# EAGLE design relaiscard (EAGLE 4.15)
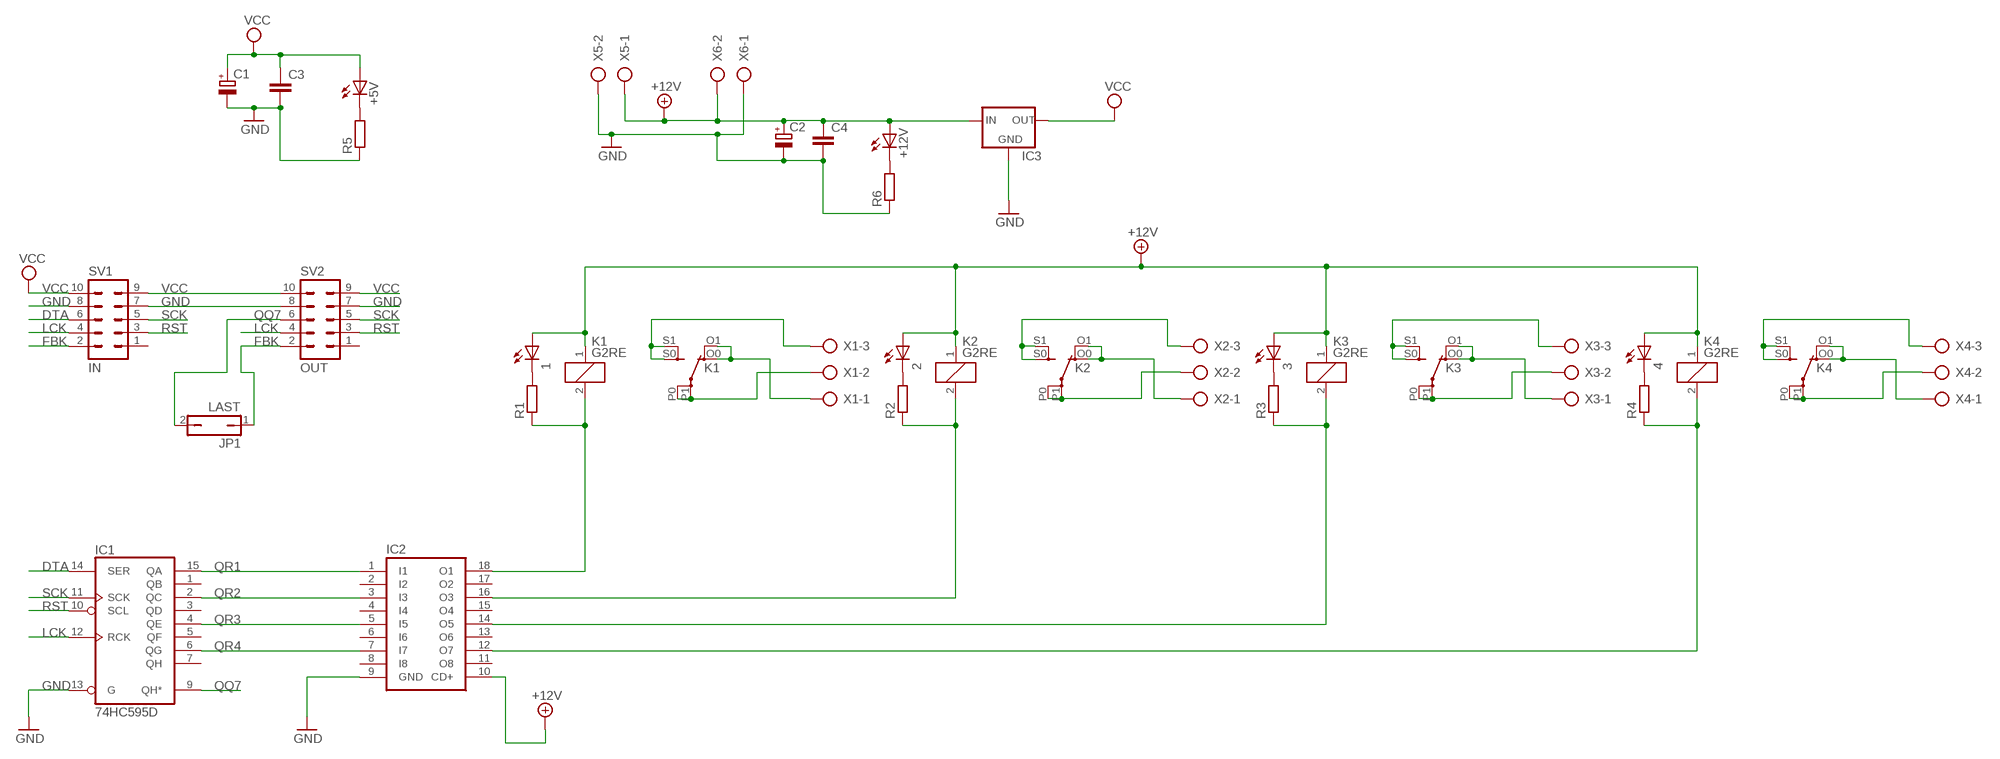
[diagram p0: schematic, sheet 1]

## Parts
1  LEDCHIPLED_1206  [CHIPLED_1206]
2  LEDCHIPLED_1206  [CHIPLED_1206]
3  LEDCHIPLED_1206  [CHIPLED_1206]
4  LEDCHIPLED_1206  [CHIPLED_1206]
+5V  LEDCHIPLED_1206  [CHIPLED_1206]
+12V  LEDCHIPLED_1206  [CHIPLED_1206]
C1  CPOL-EUE2.5-6  [E2,5-6]
C2  CPOL-EUE2.5-6  [E2,5-6]
C3  C-EUC1206  [C1206]
C4  C-EUC1206  [C1206]
IC1  74HC595D  [SO16]
IC2  ULN2803A  [DIL18]
IC3  78XXS  [78XXS]
JP1  LAST  JP1Q  [JP1]
K1  G2RE  [G2RE]
K2  G2RE  [G2RE]
K3  G2RE  [G2RE]
K4  G2RE  [G2RE]
R1  R-EU_M1206  [M1206]
R2  R-EU_M1206  [M1206]
R3  R-EU_M1206  [M1206]
R4  R-EU_M1206  [M1206]
R5  R-EU_M1206  [M1206]
R6  R-EU_M1206  [M1206]
SV1  IN  ML10  [ML10]
SV2  OUT  ML10  [ML10]
X1  AK500/3  [AK500/3]
X2  AK500/3  [AK500/3]
X3  AK500/3  [AK500/3]
X4  AK500/3  [AK500/3]
X5  AK500/2  [AK500/2]
X6  AK500/2  [AK500/2]

## Nets
+12V: 1.A 2.A 3.A 4.A +12V.A C2.+ C4.1 IC2.10(CD+) IC3.IN K1.1 K2.1 K3.1 K4.1 X5.1 X6.2
DTA: IC1.14(SER) SV1.6
FBK: JP1.1 SV1.2 SV2.2
GND: C1.- C2.- C3.2 C4.2 IC1.13(G) IC2.9(GND) IC3.GND R5.1 R6.1 SV1.7 SV1.8 SV2.7 SV2.8 X5.2 X6.1
LCK: IC1.12(RCK) SV1.4 SV2.4
N$1: K1.P0(2:P) K1.P1(2:P) X1.2
N$2: K1.S0(2:S) K1.S1(2:S) X1.3
N$3: K2.P0(2:P) K2.P1(2:P) X2.2
N$4: K1.O0(2:O) K1.O1(2:O) X1.1
N$5: K2.O0(2:O) K2.O1(2:O) X2.1
N$6: K2.S0(2:S) K2.S1(2:S) X2.3
N$7: K3.S0(2:S) K3.S1(2:S) X3.3
N$8: K3.O0(2:O) K3.O1(2:O) X3.1
N$9: K3.P0(2:P) K3.P1(2:P) X3.2
N$10: K4.S0(2:S) K4.S1(2:S) X4.3
N$11: K4.O0(2:O) K4.O1(2:O) X4.1
N$12: K4.P0(2:P) K4.P1(2:P) X4.2
N$13: IC2.18(O1) K1.2 R1.1
N$14: IC2.16(O3) K2.2 R2.1
N$15: IC2.14(O5) K3.2 R3.1
N$16: IC2.12(O7) K4.2 R4.1
N$19: +5V.C R5.2
N$20: 1.C R1.2
N$21: 2.C R2.2
N$22: 3.C R3.2
N$23: 4.C R4.2
N$26: +12V.C R6.2
QQ7: IC1.9(QH*) JP1.2 SV2.6
QR1: IC1.15(QA) IC2.1(I1)
QR2: IC1.2(QC) IC2.3(I3)
QR3: IC1.4(QE) IC2.5(I5)
QR4: IC1.6(QG) IC2.7(I7)
RST: IC1.10(SCL) SV1.3 SV2.3
SCK: IC1.11(SCK) SV1.5 SV2.5
VCC: +5V.A C1.+ C3.1 IC3.OUT SV1.9 SV1.10 SV2.9 SV2.10
Unconnected: IC1.1(QB) IC1.3(QD) IC1.5(QF) IC1.7(QH) IC2.2(I2) IC2.4(I4) IC2.6(I6) IC2.8(I8) IC2.11(O8) IC2.13(O6) IC2.15(O4) IC2.17(O2) SV1.1 SV2.1

## Power pins joined to a net without a drawn wire
GND: IC1.8(GND)
VCC: IC1.16(VCC)

## Library data of the parts
1-4 +5V +12V = led:LED: LED OSRAM: - CHIPLED LG R971, LG N971, LY N971, LG Q971, LY Q971, LO R971, LY R971 LH N974, LH R974 LS Q976, LO Q976, LY Q976 LO Q996 - Hyper CHIPLED LW Q18S LB Q993, LB Q99A, LB R99A - SideLED LS A670, LO A670, LY A670, LG A670, LP A670 LB A673, LV A673, LT A673, LW A673 LH A674 LY A675 LS A676, LA A676, LO A676, LY A676, LW A676 LS A679, LY A679, LG A679 - Hyper Micro SIDELED® LS Y876, LA Y876, LO Y876, LY Y876 LT Y87S - SmartLED LW L88C, LW L88S LB L89C, LB L89S, LG L890 LS L89K, LO L89K, LY L89K LS L896, LA L896, LO L896, LY L896 - TOPLED LS T670, LO T670, LY T670, LG T670, LP T670 LSG T670, LSP T670, LSY T670, LOP T670, LYG T670 LG T671, LOG T671, LSG T671 LB T673, LV T673, LT T673, LW T673 LH T674 LS T676, LA T676, LO T676, LY T676, LB T676, LH T676, LSB T676, LW T676 LB T67C, LV T67C, LT T67C, LS T67K, LO T67K, LY T67K, LW E67C LS E67B, LA E67B, LO E67B, LY E67B, LB E67C, LV E67C, LT E67C LW T67C LS T679, LY T679, LG T679 LS T770, LO T770, LY T770, LG T770, LP T770 LB T773, LV T773, LT T773, LW T773 LH T774 LS E675, LA E675, LY E675, LS T675 LS T776, LA T776, LO T776, LY T776, LB T776 LHGB T686 LT T68C, LB T68C - Hyper Mini TOPLED® LB M676 - Mini TOPLED Santana® LG M470 LS M47K, LO M47K, LY M47K Source: http://www.osram.convergy.de/
C1 C2 = relaiscard:CPOL-EU: POLARIZED CAPACITOR, European symbol
C3 C4 = rcl:C-EU: CAPACITOR, European symbol
IC1 = 74xx-eu:74*595: 8-bit SHIFT REGISTER, output latch
IC2 = relaiscard:ULN2803A: DRIVER ARRAY
IC3 = relaiscard:78XXS: VOLTAGE REGULATOR
JP1 = relaiscard:JP1Q: JUMPER
K1-K4 = relaiscard:G2RE: RELAY 1 x switch, high current, Omron
R1-R6 = rcl:R-EU_: RESISTOR, European symbol
SV1 SV2 = relaiscard:ML10: HARTING
X1-X4 = relaiscard:AK500/3: CONNECTOR
X5 X6 = relaiscard:AK500/2: CONNECTOR

## Board
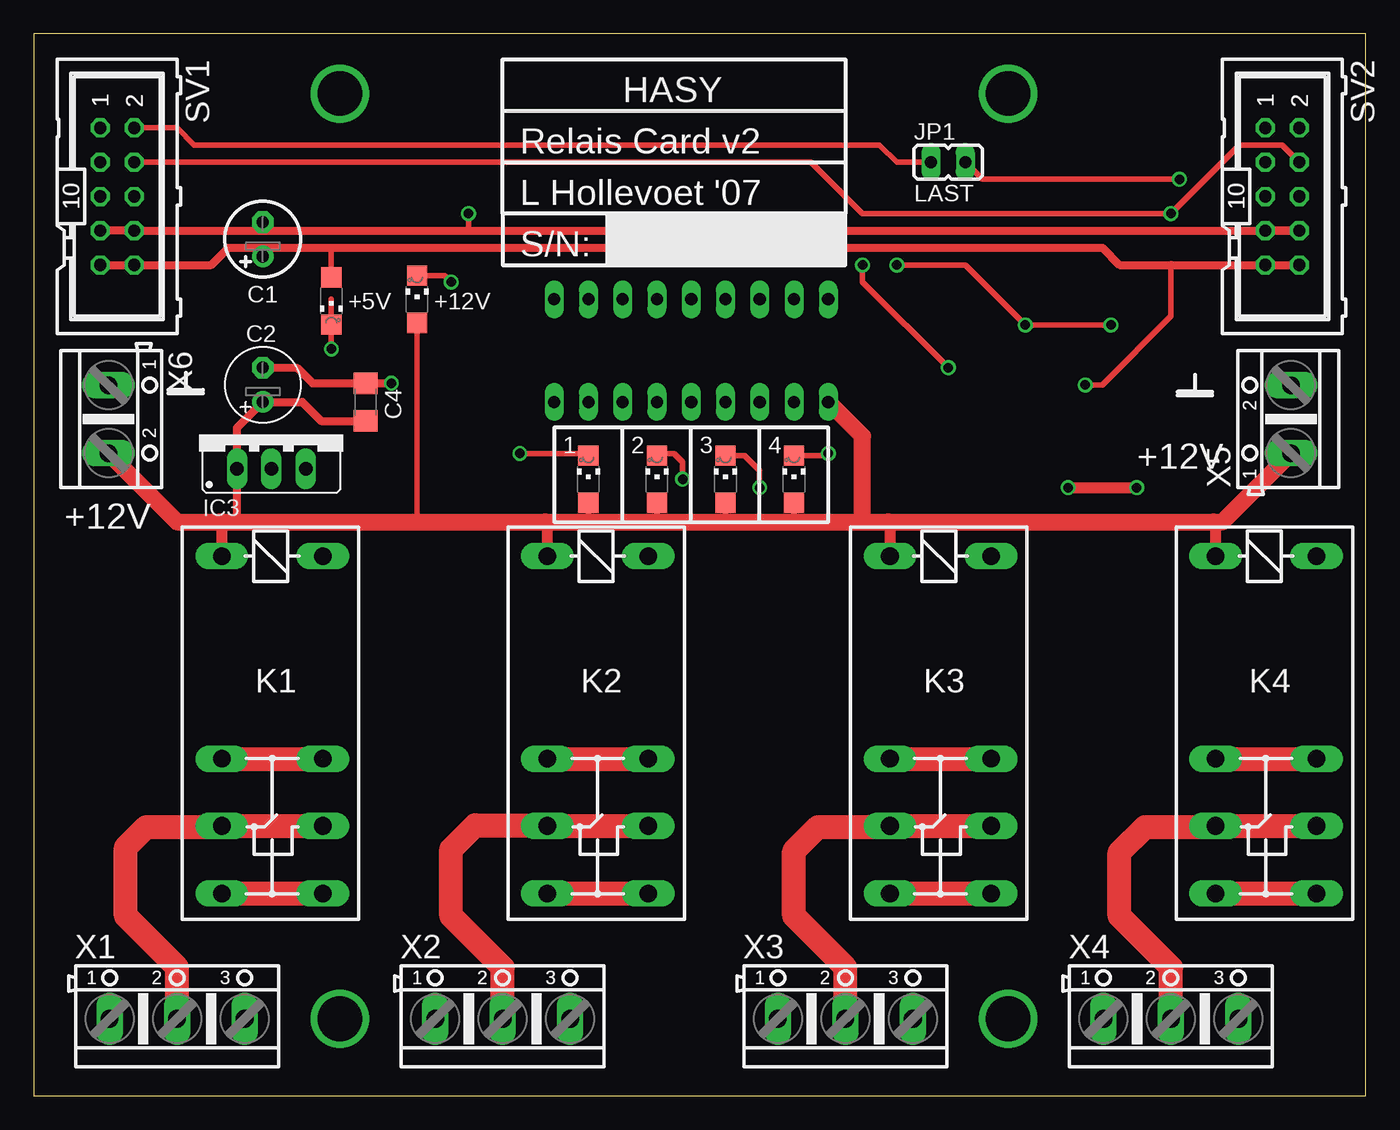
[diagram p1: board, top side]
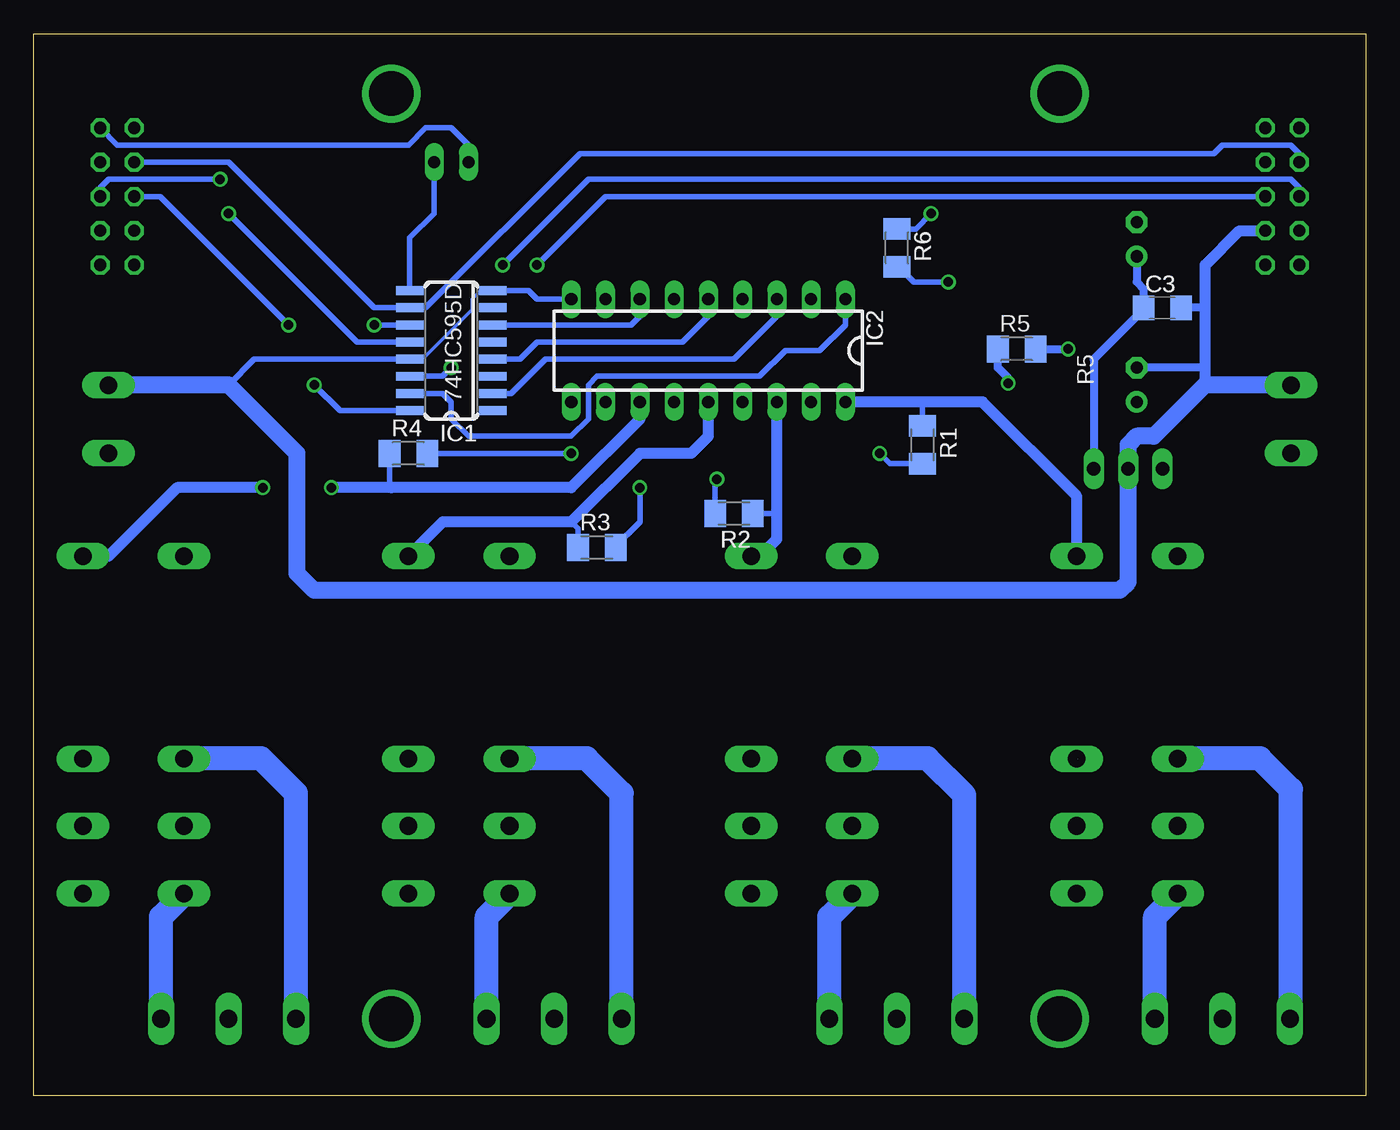
[diagram p2: board, bottom side, seen from below]

Size 98.73 x 78.73 mm. Coordinates in mm from the lower left corner, seen from the top.
Outline: 0,0 98.73,0 98.73,78.73 0,78.73 0,0
Copper layers (1*16): Top 0.035mm / dielectric 1.5mm / Bottom 0.035mm
Design rules "10mils_olimex": minimum track width 10mil, minimum drill 24mil, track to track 10mil, track to pad 10mil, pad to pad 10mil, via to via 10mil, smd to smd 10mil, copper to edge 40mil, drill to drill 10mil, minimum pad ring 10mil, minimum via ring 8mil, stop-mask expansion 0mil, vias tented up to drill 0mil, thermal gap 10mil
tRestrict: area 19.9,2.9 to 25.5,8.5; area 19.9,71.5 to 25.5,77.1; area 69.4,2.9 to 75.1,8.5; area 69.4,71.5 to 75.1,77.1
bRestrict: area 19.9,2.9 to 25.5,8.5; area 19.9,71.5 to 25.5,77.1; area 69.4,2.9 to 75.1,8.5; area 69.4,71.5 to 75.1,77.1
vRestrict: area 19.9,71.5 to 25.5,77.1; area 19.9,2.9 to 25.5,8.5; area 69.4,2.9 to 75.1,8.5; area 69.4,71.5 to 75.1,77.1

### Footprints (pad centres in the part's own frame; a part is rotated, then mirrored left to right if it is on the bottom)
CHIPLED_1206 = smd 1.5 x 1.5: A 0,-1.75; C 0,1.75
E2,5-6 = drill 0.9 pad 1.6 round: + -1.27,0 | drill 0.9 pad 1.6 octagon: - 1.27,0
C1206 = smd 1.6 x 1.8: 1 -1.4,0; 2 1.4,0
SO16 = smd 0.66 x 2.032: 1 -4.445,-3.073; 2 -3.175,-3.073; 3 -1.905,-3.073; 4 -0.635,-3.073; 5 0.635,-3.073; 6 1.905,-3.073; 7 3.175,-3.073; 8 4.445,-3.073; 9 4.445,3.073; 10 3.175,3.073; 11 1.905,3.073; 12 0.635,3.073; 13 -0.635,3.073; 14 -1.905,3.073; 15 -3.175,3.073; 16 -4.445,3.073
DIL18 = drill 0.9 long: 1 -10.16,-3.81; 2 -7.62,-3.81; 3 -5.08,-3.81; 4 -2.54,-3.81; 5 0,-3.81; 6 2.54,-3.81; 7 5.08,-3.81; 8 7.62,-3.81; 9 10.16,-3.81; 10 10.16,3.81; 11 7.62,3.81; 12 5.08,3.81; 13 2.54,3.81; 14 0,3.81; 15 -2.54,3.81; 16 -5.08,3.81; 17 -7.62,3.81; 18 -10.16,3.81
78XXS = drill 1 long: GND 0,-2.54; IN -2.54,-2.54; OUT 2.54,-2.54
JP1 = drill 0.9 long: 1 0,-1.27; 2 0,1.27
G2RE = drill 1.3 long: 1 -2.54,-3.683; 2 -2.54,3.81; O0 12.471,-3.683; O1 12.471,3.81; P0 17.45,-3.683; P1 17.45,3.81; S0 22.454,-3.683; S1 22.454,3.81
M1206 = smd 1.6 x 2: 1 -1.4,0; 2 1.4,0
ML10 = drill 0.9 octagon: 1 -5.08,-1.27; 2 -5.08,1.27; 3 -2.54,-1.27; 4 -2.54,1.27; 5 0,-1.27; 6 0,1.27; 7 2.54,-1.27; 8 2.54,1.27; 9 5.08,-1.27; 10 5.08,1.27
AK500/3 = drill 1.3 long: 1 -5.004,0; 2 0,0; 3 5.004,0
AK500/2 = drill 1.3 long: 1 -2.515,0; 2 2.515,0

### Placement (x,y rotation side)
1  41.11,45.71 0 top
2  46.19,45.71 0 top
3  51.27,45.71 0 top
4  56.35,45.71 0 top
+5V  22.06,58.92 180 top
+12V  28.41,59.05 0 top
C1  16.98,63.5 90 top
C2  16.98,52.7 90 top
C3  15.07,58.41 0 bottom
C4  24.6,51.43 90 top
IC1  67.78,55.24 90 bottom
IC2  48.73,55.24 180 bottom
IC3  17.61,49.02 0 top
JP1  67.78,69.21 270 top
K1  17.61,37.46 270 top
K2  41.75,37.46 270 top
K3  67.14,37.46 270 top
K4  91.28,37.46 270 top
R1  32.86,48.26 270 bottom
R2  46.83,43.17 180 bottom
R3  56.98,40.63 0 bottom
R4  70.95,47.62 0 bottom
R5  25.87,55.37 0 bottom
R6  34.76,62.86 270 bottom
SV1  6.19,66.67 270 top
SV2  92.55,66.67 270 top
X1  10.63,5.71 0 top
X2  34.76,5.71 0 top
X3  60.16,5.71 0 top
X4  84.29,5.71 0 top
X5  93.18,50.16 90 top
X6  5.55,50.16 270 top

### Tracks (layer width: path | path; a pad name or v marks a point on that pad's centre or on a via)
+12V
  Top 0.406: 41.11,42.54 1.A | 51.27,42.54 3.A | 56.35,42.54 4.A | 46.19,42.54 2.A | 28.41,42.54 +12V.A
  Top 0.61: C4.1 21.3,50.03 19.9,51.43 C2.+ 15.07,49.52 IC3.IN 15.07,42.54
  Top 0.813: K1.1 13.93,42.41 13.8,42.54 | K2.1 38.06,42.41 37.94,42.54 | K3.1 63.46,42.41 63.34,42.54 | K4.1 87.59,42.41 87.47,42.54
  Top 1.27: X6.2 5.55,47.62 10.63,42.54 13.8,42.54 15.07,42.54 28.41,42.54 37.94,42.54 41.11,42.54 46.19,42.54 51.27,42.54 56.35,42.54 61.43,42.54 | X5.1 93.18,47.62 88.1,42.54 87.47,42.54 63.34,42.54 61.43,42.54 | IC2.10 61.43,48.89 61.43,42.54
DTA  (via drill 0.7)
  Top 0.406: v61.43,61.59 61.43,60.32 v67.78,53.97
  Bottom 0.406: SV1.6 56.35,66.67 v61.43,61.59 | v67.78,53.97 68.42,53.34 IC1.14 70.95,53.34
FBK
  Top 0.406: SV1.2 10.63,71.75 11.9,70.48 62.7,70.48 63.97,69.21 JP1.1
  Bottom 0.406: JP1.1 66.51,70.48 67.78,71.75 69.69,71.75 70.95,70.48 92.55,70.48 SV2.2
GND  (via drill 0.7)
  Top 0.406: 32.22,64.13 v32.22,65.4
  Top 0.61: SV2.7 SV2.8 32.22,64.13 16.98,64.13 | 16.98,64.13 SV1.8 SV1.7 | 16.98,64.13 C1.- | C2.- 19.52,53.97 20.66,52.83 C4.2 v26.5,52.83
  Bottom 0.254: IC1.13 70.07,54.73 69.81,54.73 66.26,58.29 66.26,59.05 65.49,59.81 IC1.8
  Bottom 0.406: IC1.8 62.07,59.69 61.43,59.05 IC2.9 | IC1.13 82.39,54.6 84.29,52.7 | R6.1 33.36,64.26 v32.22,65.4
  Bottom 0.61: 11.9,58.41 C3.2 | 11.9,53.97 C2.- | v26.5,52.83 26.5,53.21 27.27,53.97 27.27,55.24 R5.1
  Bottom 0.813: 93.18,52.7 X5.2 | 5.55,52.7 11.9,52.7 11.9,53.97 11.9,58.41 11.9,61.59 9.36,64.13 SV1.8
  Bottom 1.27: 93.18,52.7 84.29,52.7 79.21,47.62 79.21,38.73 77.94,37.46 18.25,37.46 17.61,38.09 IC3.GND 17.61,48.26 16.98,48.89 15.71,48.89 11.92,52.67 5.58,52.67 5.55,52.7 X6.1
LCK  (via drill 0.7)
  Top 0.406: SV1.4 57.62,69.21 61.43,65.4 v84.29,65.4 89.37,70.48 92.55,70.48 SV2.4
  Bottom 0.406: IC1.12 74.77,55.88 v84.29,65.4
N$1
  Top 1.778: X1.2 10.63,9.52 6.82,13.33 6.82,18.41 8.34,19.93 13.93,19.93 K1.P0 13.93,20.06 13.98,20.01 K1.P1
N$2
  Top 1.778: K1.S1 21.43,14.98 21.4,15.01 K1.S0
  Bottom 1.778: K1.S0 13.93,14.98 15.63,13.28 X1.3
N$3
  Top 1.778: X2.2 34.76,9.52 30.95,13.33 30.95,18.28 32.73,20.06 38.06,20.06 K2.P0 38.06,19.93 38.14,20.01 K2.P1
N$4  (1 unrouted)
  Top 1.778: K1.O1 21.32,24.99 21.3,25.01 21.27,24.99 K1.O0
  Bottom 1.778: X1.1 5.55,5.71 5.55,22.73 7.84,25.01 13.8,25.01 13.83,24.99 K1.O0 | 21.32,24.99 21.3,25.01 21.27,24.99
N$5
  Top 1.778: 45.66,24.99 K2.O1 | K2.O0 45.66,24.99 | 45.66,24.99 45.68,25.01
  Bottom 1.778: X2.1 29.76,22.3 32.47,25.01 38.06,25.01 K2.O0
N$6
  Top 1.778: K2.S1 45.55,14.98 45.53,15.01 K2.S0
  Bottom 1.778: K2.S0 38.06,14.98 39.76,13.28 X2.3
N$7
  Top 1.778: K3.S1 70.95,14.98 70.93,15.01 K3.S0
  Bottom 1.778: 63.44,15.01 63.34,15.11 | 63.44,15.01 K3.S0 | X3.3 65.16,13.28 63.44,15.01
N$8
  Top 1.778: K3.O1 70.95,25.01 70.93,24.99 K3.O0
  Bottom 1.778: X3.1 55.16,22.42 57.75,25.01 63.59,25.01 63.56,24.99 K3.O0
N$9
  Top 1.778: X3.2 60.16,9.52 56.35,13.33 56.35,18.16 58.13,19.93 63.59,19.93 63.51,20.01 K3.P0 63.39,20.01 | 63.39,20.01 K3.P1 | 63.39,20.01 63.34,20.06
N$10
  Top 1.778: K4.S1 94.98,15.01 94.96,14.98 94.93,15.01 K4.S0
  Bottom 1.778: K4.S0 87.59,14.98 89.29,13.28 X4.3
N$11
  Top 1.778: K4.O1 94.98,24.99 94.96,25.01 94.93,24.99 K4.O0
  Bottom 1.778: X4.1 79.29,22.42 81.88,25.01 87.34,25.01 87.36,24.99 K4.O0
N$12
  Top 1.778: X4.2 84.29,9.52 80.48,13.33 80.48,18.03 82.39,19.93 87.21,19.93 87.34,20.06 87.39,20.01 K4.P0 87.67,20.01 87.72,20.06 87.77,20.01 K4.P1
N$13
  Bottom 0.406: 32.86,51.43 R1.1
  Bottom 0.813: IC2.18 32.86,51.43 28.41,51.43 21.43,44.45 K1.2
N$14
  Bottom 0.406: 43.65,43.17 R2.1
  Bottom 0.813: IC2.16 43.65,43.17 43.65,41.27 44.92,40 K2.2
N$15
  Bottom 0.406: R3.1 58.39,42.03 58.89,42.54
  Bottom 0.813: IC2.14 48.73,48.89 50,47.62 53.81,47.62 58.89,42.54 68.42,42.54 K3.2
N$16  (via drill 0.7)
  Top 0.813: v76.67,45.08 v81.75,45.08
  Bottom 0.406: R4.1 72.36,45.21 72.23,45.08
  Bottom 0.813: IC2.12 53.81,50.16 58.89,45.08 72.23,45.08 v76.67,45.08 | v81.75,45.08 88.1,45.08 93.18,40 K4.2
N$17  (via drill 3.3)
  other vias: 72.23,5.71
N$18  (via drill 3.3)
  other vias: 22.7,74.29
N$19  (via drill 0.7)
  Top 0.406: 22.06,59.05 +5V.C v22.06,55.37
  Bottom 0.406: v22.06,55.37 22.06,55.24 22.19,55.37
  Bottom 0.61: R5.2 24.6,55.24 | R5.2 | 22.19,55.37 R5.2
N$20  (via drill 0.7)
  Top 0.406: 1.C 41.11,47.62 v36.03,47.62
  Bottom 0.406: R1.2 35.27,46.85 v36.03,47.62
N$21  (via drill 0.7)
  Top 0.406: v48.1,45.71 48.1,46.98 47.46,47.62 46.19,47.62 2.C
  Bottom 0.406: R2.2 48.23,45.59 v48.1,45.71
N$22  (via drill 0.7)
  Top 0.406: 3.C 52.7,47.46 53.81,46.35 v53.81,45.08
  Bottom 0.406: R3.2 55.72,40.63 53.81,42.54 v53.81,45.08
N$23  (via drill 0.7)
  Top 0.406: 4.C 58.73,47.46 v58.89,47.62
  Bottom 0.406: 69.69,47.62 R4.2 v58.89,47.62
N$24  (via drill 3.3)
  other vias: 72.23,74.29
N$25  (via drill 3.3)
  other vias: 22.7,5.71
N$26  (via drill 0.7)
  Top 0.406: +12V.C 30.47,60.8 v30.95,60.32
  Bottom 0.406: R6.2 34.76,61.59 33.49,60.32 v30.95,60.32
QQ7  (via drill 0.7)
  Top 0.406: v84.92,67.94 70.32,67.94 JP1.2
  Bottom 0.406: IC1.9 70.85,63.6 69.05,65.4 JP1.2 | SV2.6 93.81,67.3 93.18,67.94 v84.92,67.94
QR1
  Bottom 0.406: IC1.15 68.42,52.06 67.78,51.43 67.78,50.16 66.51,48.89 58.89,48.89 57.62,50.16 57.62,52.7 56.98,53.34 44.92,53.34 43.02,55.24 40.48,55.24 38.57,57.14 IC2.1
QR2
  Bottom 0.406: IC1.2 63.34,52.06 60.8,54.6 46.83,54.6 43.65,57.78 IC2.3
QR3
  Bottom 0.406: IC1.4 62.7,54.6 61.43,55.88 50.64,55.88 48.73,57.78 IC2.5
QR4
  Bottom 0.406: IC1.6 54.45,57.14 53.81,57.78 IC2.7
RST
  Bottom 0.406: SV1.3 4.92,69.84 5.55,70.48 10.63,70.48 11.26,69.84 58.26,69.84 69.69,58.41 IC1.10 73.5,58.41 84.29,69.21 SV2.3
SCK  (via drill 0.7)
  Top 0.406: v79.84,57.14 v73.5,57.14 69.05,61.59 v63.97,61.59
  Bottom 0.406: v73.5,57.14 IC1.11 | v79.84,57.14 89.37,66.67 SV2.5 | SV1.5 4.92,67.3 5.55,67.94 57.62,67.94 v63.97,61.59
VCC  (via drill 0.7)
  Top 0.406: 22.06,62.86 +5V.A | v77.94,52.7 79.21,52.7 84.29,57.78 84.29,61.59
  Top 0.61: SV1.9 SV1.10 13.17,61.59 14.44,62.86 16.98,62.86 | 16.98,62.86 22.06,62.86 79.21,62.86 80.48,61.59 84.29,61.59 SV2.9 SV2.10 | 16.98,62.86 C1.+
  Bottom 0.406: IC1.16 76.03,50.8 v77.94,52.7
  Bottom 0.61: C1.+ 16.98,60.32 16.47,59.81 C3.1 16.34,58.41 20.15,54.6 IC3.OUT

### Text on the board
tPlace: HASY | Relais Card v2 | L Hollevoet '07 | S/N: | +12V | +12V
tNames: 1 | 2 | 1 | 2 | 10 | 10 | 1 | 2 | 2 | 1 | 1 | 2 | 3 | 1 | 2 | 3 | 1 | 2 | 3 | 1 | 2 | 3
bNames: R6 | C3 | IC2 | R5 | 74HC595D | R1 | IC1 | R4 | R2 | R3
tTest: LH